# EAGLE schematic display_board (EAGLE 5.07)
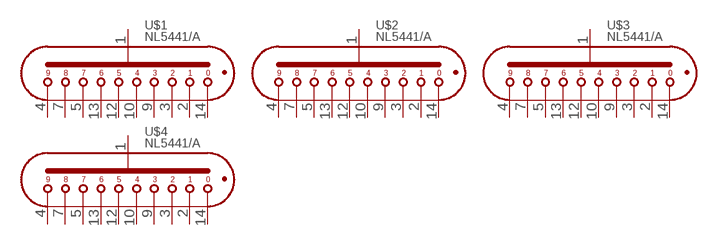
[diagram p0: schematic, sheet 1]

## Parts
U$1  NL5441/A  NL5441/ACOMPUTED  [BURROUGHS-16-MINI2]
U$2  NL5441/A  NL5441/ACOMPUTED  [BURROUGHS-16-MINI2]
U$3  NL5441/A  NL5441/ADRAWN  [BURROUGHS-16-MINI]
U$4  NL5441/A  NL5441/ACOMPUTED  [BURROUGHS-16-MINI2]
Unconnected: U$1.1(A) U$1.2 U$1.3 U$1.4 U$1.5 U$1.7 U$1.9 U$1.10 U$1.12 U$1.13 U$1.14 U$2.1(A) U$2.2 U$2.3 U$2.4 U$2.5 U$2.7 U$2.9 U$2.10 U$2.12 U$2.13 U$2.14 U$3.1(A) U$3.2 U$3.3 U$3.4 U$3.5 U$3.7 U$3.9 U$3.10 U$3.12 U$3.13 U$3.14 U$4.1(A) U$4.2 U$4.3 U$4.4 U$4.5 U$4.7 U$4.9 U$4.10 U$4.12 U$4.13 U$4.14

## Library data of the parts
U$1-U$4 = nixie_tube:NL5441/A